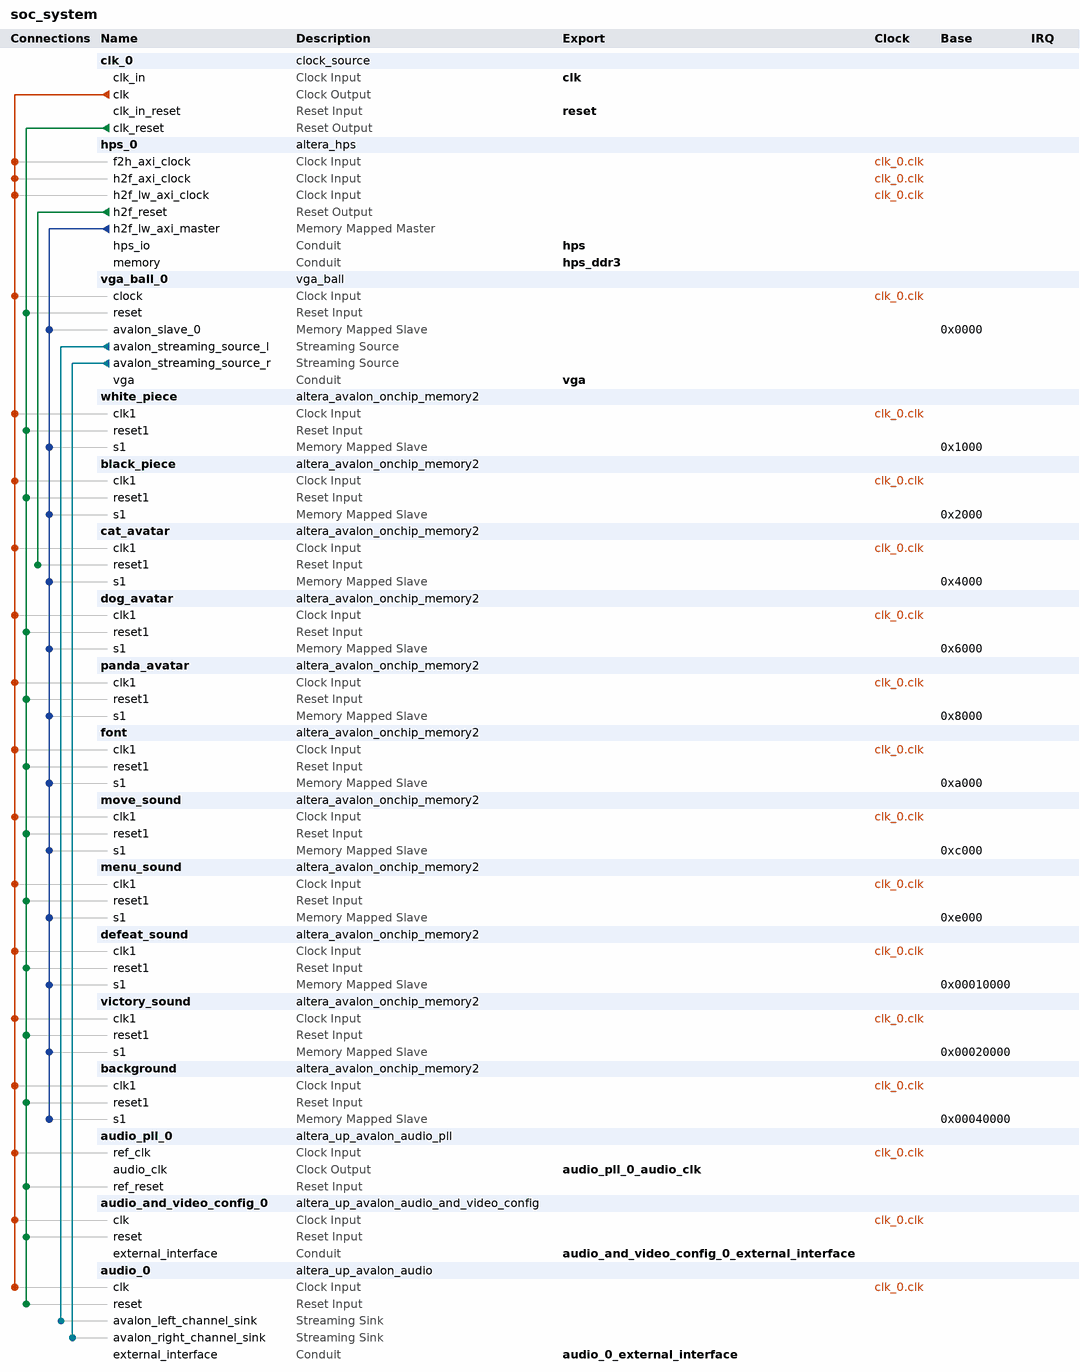
[diagram p0: system contents]
# Platform Designer (Qsys) system soc_system, Cyclone V 5CSEMA5F31C6
# Parameters at their usual value, and those the tool derives, are not listed.
package require -exact qsys 21.1
create_system soc_system
set_project_property DEVICE_FAMILY {Cyclone V}
set_project_property DEVICE 5CSEMA5F31C6

add_instance clk_0 clock_source 21.1
set_instance_parameter_value clk_0 clockFrequency 50000000

add_instance hps_0 altera_hps 21.1
set_instance_parameter_value hps_0 EMAC1_Mode RGMII
set_instance_parameter_value hps_0 EMAC1_PinMuxing {HPS I/O Set 0}
set_instance_parameter_value hps_0 F2SCLK_COLDRST_Enable false
set_instance_parameter_value hps_0 F2SCLK_DBGRST_Enable false
set_instance_parameter_value hps_0 F2SCLK_WARMRST_Enable false
set_instance_parameter_value hps_0 F2SINTERRUPT_Enable true
set_instance_parameter_value hps_0 F2S_Width 2
set_instance_parameter_value hps_0 FPGA_PERIPHERAL_OUTPUT_CLOCK_FREQ_EMAC0_GTX_CLK 125
set_instance_parameter_value hps_0 FPGA_PERIPHERAL_OUTPUT_CLOCK_FREQ_EMAC0_MD_CLK 2.5
set_instance_parameter_value hps_0 FPGA_PERIPHERAL_OUTPUT_CLOCK_FREQ_EMAC1_GTX_CLK 125
set_instance_parameter_value hps_0 FPGA_PERIPHERAL_OUTPUT_CLOCK_FREQ_EMAC1_MD_CLK 2.5
set_instance_parameter_value hps_0 HPS_PROTOCOL DDR3
set_instance_parameter_value hps_0 I2C0_Mode I2C
set_instance_parameter_value hps_0 I2C0_PinMuxing {HPS I/O Set 0}
set_instance_parameter_value hps_0 I2C1_Mode I2C
set_instance_parameter_value hps_0 I2C1_PinMuxing {HPS I/O Set 0}
set_instance_parameter_value hps_0 LWH2F_Enable true
set_instance_parameter_value hps_0 MEM_BANKADDR_WIDTH 3
set_instance_parameter_value hps_0 MEM_CLK_FREQ 400.0
set_instance_parameter_value hps_0 MEM_COL_ADDR_WIDTH 10
set_instance_parameter_value hps_0 MEM_DQ_WIDTH 32
set_instance_parameter_value hps_0 MEM_DRV_STR RZQ/7
set_instance_parameter_value hps_0 MEM_ROW_ADDR_WIDTH 15
set_instance_parameter_value hps_0 MEM_RTT_NOM RZQ/4
set_instance_parameter_value hps_0 MEM_RTT_WR RZQ/4
set_instance_parameter_value hps_0 MEM_TCL 11
set_instance_parameter_value hps_0 MEM_TFAW_NS 30.0
set_instance_parameter_value hps_0 MEM_TRAS_NS 35.0
set_instance_parameter_value hps_0 MEM_TRCD_NS 13.75
set_instance_parameter_value hps_0 MEM_TRFC_NS 260.0
set_instance_parameter_value hps_0 MEM_TRP_NS 13.75
set_instance_parameter_value hps_0 MEM_TRRD_NS 7.7
set_instance_parameter_value hps_0 MEM_VENDOR JEDEC
set_instance_parameter_value hps_0 MEM_WTCL 8
set_instance_parameter_value hps_0 QSPI_Mode N/A
set_instance_parameter_value hps_0 QSPI_PinMuxing Unused
set_instance_parameter_value hps_0 REF_CLK_FREQ 25.0
set_instance_parameter_value hps_0 S2FCLK_USER1CLK_Enable true
set_instance_parameter_value hps_0 S2FCLK_USER1CLK_FREQ 50.0
set_instance_parameter_value hps_0 S2FCLK_USER2CLK 5
set_instance_parameter_value hps_0 S2F_Width 2
set_instance_parameter_value hps_0 SDIO_Mode {4-bit Data}
set_instance_parameter_value hps_0 SDIO_PinMuxing {HPS I/O Set 0}
set_instance_parameter_value hps_0 SPIM1_Mode {Single Slave Select}
set_instance_parameter_value hps_0 SPIM1_PinMuxing {HPS I/O Set 0}
set_instance_parameter_value hps_0 STM_Enable false
set_instance_parameter_value hps_0 TIMING_BOARD_AC_SKEW 0.03
set_instance_parameter_value hps_0 TIMING_BOARD_AC_TO_CK_SKEW 0.0
set_instance_parameter_value hps_0 TIMING_BOARD_DQ_TO_DQS_SKEW 0.0
set_instance_parameter_value hps_0 TIMING_BOARD_MAX_CK_DELAY 0.03
set_instance_parameter_value hps_0 TIMING_BOARD_MAX_DQS_DELAY 0.02
set_instance_parameter_value hps_0 TIMING_BOARD_SKEW_BETWEEN_DQS 0.08
set_instance_parameter_value hps_0 TIMING_BOARD_SKEW_CKDQS_DIMM_MAX 0.16
set_instance_parameter_value hps_0 TIMING_BOARD_SKEW_CKDQS_DIMM_MIN 0.09
set_instance_parameter_value hps_0 TIMING_BOARD_SKEW_WITHIN_DQS 0.01
set_instance_parameter_value hps_0 TIMING_TDH 65
set_instance_parameter_value hps_0 TIMING_TDQSCK 255
set_instance_parameter_value hps_0 TIMING_TDQSQ 125
set_instance_parameter_value hps_0 TIMING_TDS 30
set_instance_parameter_value hps_0 TIMING_TIH 140
set_instance_parameter_value hps_0 TIMING_TIS 180
set_instance_parameter_value hps_0 TIMING_TQSH 0.4
set_instance_parameter_value hps_0 UART0_Mode {No Flow Control}
set_instance_parameter_value hps_0 UART0_PinMuxing {HPS I/O Set 0}
set_instance_parameter_value hps_0 USB1_Mode SDR
set_instance_parameter_value hps_0 USB1_PinMuxing {HPS I/O Set 0}
set_instance_parameter_value hps_0 desired_cfg_clk_mhz 50.0
set_instance_parameter_value hps_0 desired_qspi_clk_mhz 400.0

add_instance vga_ball_0 vga_ball 1.0

add_instance white_piece altera_avalon_onchip_memory2 21.1
set_instance_parameter_value white_piece dataWidth 8
set_instance_parameter_value white_piece dualPort false
set_instance_parameter_value white_piece initMemContent true
set_instance_parameter_value white_piece initializationFileName mif/white_piece.mif
set_instance_parameter_value white_piece memorySize 1023
set_instance_parameter_value white_piece useNonDefaultInitFile true
set_instance_parameter_value white_piece writable false

add_instance black_piece altera_avalon_onchip_memory2 21.1
set_instance_parameter_value black_piece dataWidth 8
set_instance_parameter_value black_piece dualPort false
set_instance_parameter_value black_piece initMemContent true
set_instance_parameter_value black_piece initializationFileName mif/black_piece.mif
set_instance_parameter_value black_piece memorySize 1023
set_instance_parameter_value black_piece useNonDefaultInitFile true
set_instance_parameter_value black_piece writable false

add_instance cat_avatar altera_avalon_onchip_memory2 21.1
set_instance_parameter_value cat_avatar dataWidth 8
set_instance_parameter_value cat_avatar dualPort false
set_instance_parameter_value cat_avatar initMemContent true
set_instance_parameter_value cat_avatar initializationFileName mif/cat.mif
set_instance_parameter_value cat_avatar memorySize 8192
set_instance_parameter_value cat_avatar useNonDefaultInitFile true
set_instance_parameter_value cat_avatar writable false

add_instance dog_avatar altera_avalon_onchip_memory2 21.1
set_instance_parameter_value dog_avatar dataWidth 8
set_instance_parameter_value dog_avatar dualPort false
set_instance_parameter_value dog_avatar initMemContent true
set_instance_parameter_value dog_avatar initializationFileName mif/dog.mif
set_instance_parameter_value dog_avatar memorySize 8192
set_instance_parameter_value dog_avatar useNonDefaultInitFile true
set_instance_parameter_value dog_avatar writable false

add_instance panda_avatar altera_avalon_onchip_memory2 21.1
set_instance_parameter_value panda_avatar dataWidth 8
set_instance_parameter_value panda_avatar dualPort false
set_instance_parameter_value panda_avatar initMemContent true
set_instance_parameter_value panda_avatar initializationFileName mif/panda.mif
set_instance_parameter_value panda_avatar memorySize 8192
set_instance_parameter_value panda_avatar useNonDefaultInitFile true
set_instance_parameter_value panda_avatar writable false

add_instance font altera_avalon_onchip_memory2 21.1
set_instance_parameter_value font dataWidth 8
set_instance_parameter_value font dualPort false
set_instance_parameter_value font initMemContent true
set_instance_parameter_value font initializationFileName mif/font.mif
set_instance_parameter_value font memorySize 225
set_instance_parameter_value font useNonDefaultInitFile true
set_instance_parameter_value font writable false

add_instance move_sound altera_avalon_onchip_memory2 21.1
set_instance_parameter_value move_sound dataWidth 16
set_instance_parameter_value move_sound dualPort false
set_instance_parameter_value move_sound initMemContent true
set_instance_parameter_value move_sound initializationFileName mif/move_sound.mif
set_instance_parameter_value move_sound memorySize 5744
set_instance_parameter_value move_sound useNonDefaultInitFile true
set_instance_parameter_value move_sound writable false

add_instance menu_sound altera_avalon_onchip_memory2 21.1
set_instance_parameter_value menu_sound dataWidth 16
set_instance_parameter_value menu_sound dualPort false
set_instance_parameter_value menu_sound initMemContent true
set_instance_parameter_value menu_sound initializationFileName mif/menu_sound.mif
set_instance_parameter_value menu_sound memorySize 2994
set_instance_parameter_value menu_sound useNonDefaultInitFile true
set_instance_parameter_value menu_sound writable false

add_instance defeat_sound altera_avalon_onchip_memory2 21.1
set_instance_parameter_value defeat_sound dataWidth 16
set_instance_parameter_value defeat_sound dualPort false
set_instance_parameter_value defeat_sound initMemContent true
set_instance_parameter_value defeat_sound initializationFileName mif/defeat_sound.mif
set_instance_parameter_value defeat_sound memorySize 22192
set_instance_parameter_value defeat_sound useNonDefaultInitFile true
set_instance_parameter_value defeat_sound writable false

add_instance victory_sound altera_avalon_onchip_memory2 21.1
set_instance_parameter_value victory_sound dataWidth 16
set_instance_parameter_value victory_sound dualPort false
set_instance_parameter_value victory_sound initMemContent true
set_instance_parameter_value victory_sound initializationFileName mif/victory_sound.mif
set_instance_parameter_value victory_sound memorySize 13256
set_instance_parameter_value victory_sound useNonDefaultInitFile true
set_instance_parameter_value victory_sound writable false

add_instance background altera_avalon_onchip_memory2 21.1
set_instance_parameter_value background dataWidth 8
set_instance_parameter_value background dualPort false
set_instance_parameter_value background initMemContent true
set_instance_parameter_value background initializationFileName mif/board.mif
set_instance_parameter_value background memorySize 120000
set_instance_parameter_value background useNonDefaultInitFile true
set_instance_parameter_value background writable false

add_instance audio_pll_0 altera_up_avalon_audio_pll 18.0
set_instance_parameter_value audio_pll_0 gui_refclk 50.0

add_instance audio_and_video_config_0 altera_up_avalon_audio_and_video_config 18.0
set_instance_parameter_value audio_and_video_config_0 audio_in {Microphone to ADC}
set_instance_parameter_value audio_and_video_config_0 bit_length 16
set_instance_parameter_value audio_and_video_config_0 board DE1-SoC
set_instance_parameter_value audio_and_video_config_0 line_in_bypass true
set_instance_parameter_value audio_and_video_config_0 sampling_rate {48 kHz}

add_instance audio_0 altera_up_avalon_audio 18.0
set_instance_parameter_value audio_0 audio_in true
set_instance_parameter_value audio_0 avalon_bus_type Streaming
set_instance_parameter_value audio_0 dw 16

# connections
add_connection clk_0.clk audio_0.clk clock
add_connection clk_0.clk audio_and_video_config_0.clk clock
add_connection clk_0.clk audio_pll_0.ref_clk clock
add_connection clk_0.clk background.clk1 clock
add_connection clk_0.clk black_piece.clk1 clock
add_connection clk_0.clk cat_avatar.clk1 clock
add_connection clk_0.clk defeat_sound.clk1 clock
add_connection clk_0.clk dog_avatar.clk1 clock
add_connection clk_0.clk font.clk1 clock
add_connection clk_0.clk hps_0.f2h_axi_clock clock
add_connection clk_0.clk hps_0.h2f_axi_clock clock
add_connection clk_0.clk hps_0.h2f_lw_axi_clock clock
add_connection clk_0.clk menu_sound.clk1 clock
add_connection clk_0.clk move_sound.clk1 clock
add_connection clk_0.clk panda_avatar.clk1 clock
add_connection clk_0.clk vga_ball_0.clock clock
add_connection clk_0.clk victory_sound.clk1 clock
add_connection clk_0.clk white_piece.clk1 clock
add_connection clk_0.clk_reset audio_0.reset reset
add_connection clk_0.clk_reset audio_and_video_config_0.reset reset
add_connection clk_0.clk_reset audio_pll_0.ref_reset reset
add_connection clk_0.clk_reset background.reset1 reset
add_connection clk_0.clk_reset black_piece.reset1 reset
add_connection clk_0.clk_reset defeat_sound.reset1 reset
add_connection clk_0.clk_reset dog_avatar.reset1 reset
add_connection clk_0.clk_reset font.reset1 reset
add_connection clk_0.clk_reset menu_sound.reset1 reset
add_connection clk_0.clk_reset move_sound.reset1 reset
add_connection clk_0.clk_reset panda_avatar.reset1 reset
add_connection clk_0.clk_reset vga_ball_0.reset reset
add_connection clk_0.clk_reset victory_sound.reset1 reset
add_connection clk_0.clk_reset white_piece.reset1 reset
add_connection hps_0.h2f_reset cat_avatar.reset1 reset
add_connection hps_0.h2f_lw_axi_master background.s1 avalon
set_connection_parameter_value hps_0.h2f_lw_axi_master/background.s1 baseAddress 0x00040000
add_connection hps_0.h2f_lw_axi_master black_piece.s1 avalon
set_connection_parameter_value hps_0.h2f_lw_axi_master/black_piece.s1 baseAddress 0x2000
add_connection hps_0.h2f_lw_axi_master cat_avatar.s1 avalon
set_connection_parameter_value hps_0.h2f_lw_axi_master/cat_avatar.s1 baseAddress 0x4000
add_connection hps_0.h2f_lw_axi_master defeat_sound.s1 avalon
set_connection_parameter_value hps_0.h2f_lw_axi_master/defeat_sound.s1 baseAddress 0x00010000
add_connection hps_0.h2f_lw_axi_master dog_avatar.s1 avalon
set_connection_parameter_value hps_0.h2f_lw_axi_master/dog_avatar.s1 baseAddress 0x6000
add_connection hps_0.h2f_lw_axi_master font.s1 avalon
set_connection_parameter_value hps_0.h2f_lw_axi_master/font.s1 baseAddress 0xa000
add_connection hps_0.h2f_lw_axi_master menu_sound.s1 avalon
set_connection_parameter_value hps_0.h2f_lw_axi_master/menu_sound.s1 baseAddress 0xe000
add_connection hps_0.h2f_lw_axi_master move_sound.s1 avalon
set_connection_parameter_value hps_0.h2f_lw_axi_master/move_sound.s1 baseAddress 0xc000
add_connection hps_0.h2f_lw_axi_master panda_avatar.s1 avalon
set_connection_parameter_value hps_0.h2f_lw_axi_master/panda_avatar.s1 baseAddress 0x8000
add_connection hps_0.h2f_lw_axi_master vga_ball_0.avalon_slave_0 avalon
set_connection_parameter_value hps_0.h2f_lw_axi_master/vga_ball_0.avalon_slave_0 baseAddress 0x0000
add_connection hps_0.h2f_lw_axi_master victory_sound.s1 avalon
set_connection_parameter_value hps_0.h2f_lw_axi_master/victory_sound.s1 baseAddress 0x00020000
add_connection hps_0.h2f_lw_axi_master white_piece.s1 avalon
set_connection_parameter_value hps_0.h2f_lw_axi_master/white_piece.s1 baseAddress 0x1000
add_connection vga_ball_0.avalon_streaming_source_l audio_0.avalon_left_channel_sink avalon_streaming
add_connection vga_ball_0.avalon_streaming_source_r audio_0.avalon_right_channel_sink avalon_streaming

# exported interfaces
add_interface audio_0_external_interface conduit end
set_interface_property audio_0_external_interface EXPORT_OF audio_0.external_interface
add_interface audio_and_video_config_0_external_interface conduit end
set_interface_property audio_and_video_config_0_external_interface EXPORT_OF audio_and_video_config_0.external_interface
add_interface audio_pll_0_audio_clk clock source
set_interface_property audio_pll_0_audio_clk EXPORT_OF audio_pll_0.audio_clk
add_interface clk clock sink
set_interface_property clk EXPORT_OF clk_0.clk_in
add_interface hps conduit end
set_interface_property hps EXPORT_OF hps_0.hps_io
add_interface hps_ddr3 conduit end
set_interface_property hps_ddr3 EXPORT_OF hps_0.memory
add_interface reset reset sink
set_interface_property reset EXPORT_OF clk_0.clk_in_reset
add_interface vga conduit end
set_interface_property vga EXPORT_OF vga_ball_0.vga

set_interconnect_requirement {$system} qsys_mm.clockCrossingAdapter HANDSHAKE
set_interconnect_requirement {$system} qsys_mm.enableEccProtection FALSE
set_interconnect_requirement {$system} qsys_mm.insertDefaultSlave FALSE
set_interconnect_requirement {$system} qsys_mm.maxAdditionalLatency 1

save_system soc_system.qsys
